# Altium schematic sheet YLED0603R1_YLED0603R.schdoc
size 127 x 99 mm
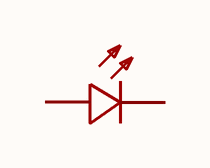
[diagram p0: YLED0603R1_YLED0603R.schdoc]

## Parts
LED?  YLED0603R  [LED0603-FD]  (value not drawn)

## Nets

Not connected (* = marked no-connect by the designer): LED? 1(+) 2(-)

## Library data of the parts
LED? = YLED0603R: Manufacturer: YONGYUTAI(永裕泰); Add into BOM: yes; Emitted Color: Red; Forward Voltage (VF): 1.8V~2.4V; Forward Current: 25mA; Dominant Wavelength: 620nm~625nm; Symbol: YLED0603R; Device: YLED0603R; LCSC Part Name: YLED0603R; Supplier Part: C19171390; Manufacturer Part: YLED0603R; Supplier Footprint: 0603; JLCPCB Part Class: Extended Part; Datasheet: https://atta.szlcsc.com/upload/public/pdf/source/20231027/FB19AF06E2C70028E58AB5CEDD1BDC72.pdf; Supplier: LCSC; Convert to PCB: yes; Power Dissipation: -; Peak Wavelength: -; Diode Configuration: -; Lens Color: -; Color Temperature: -; Luminous Intensity: -; Viewing Angle: -; Mounting Sytle: -; Operating Temperature: -40℃~+85℃